# Altium schematic sheet hdmi.SchDoc
size 386 x 246 mm
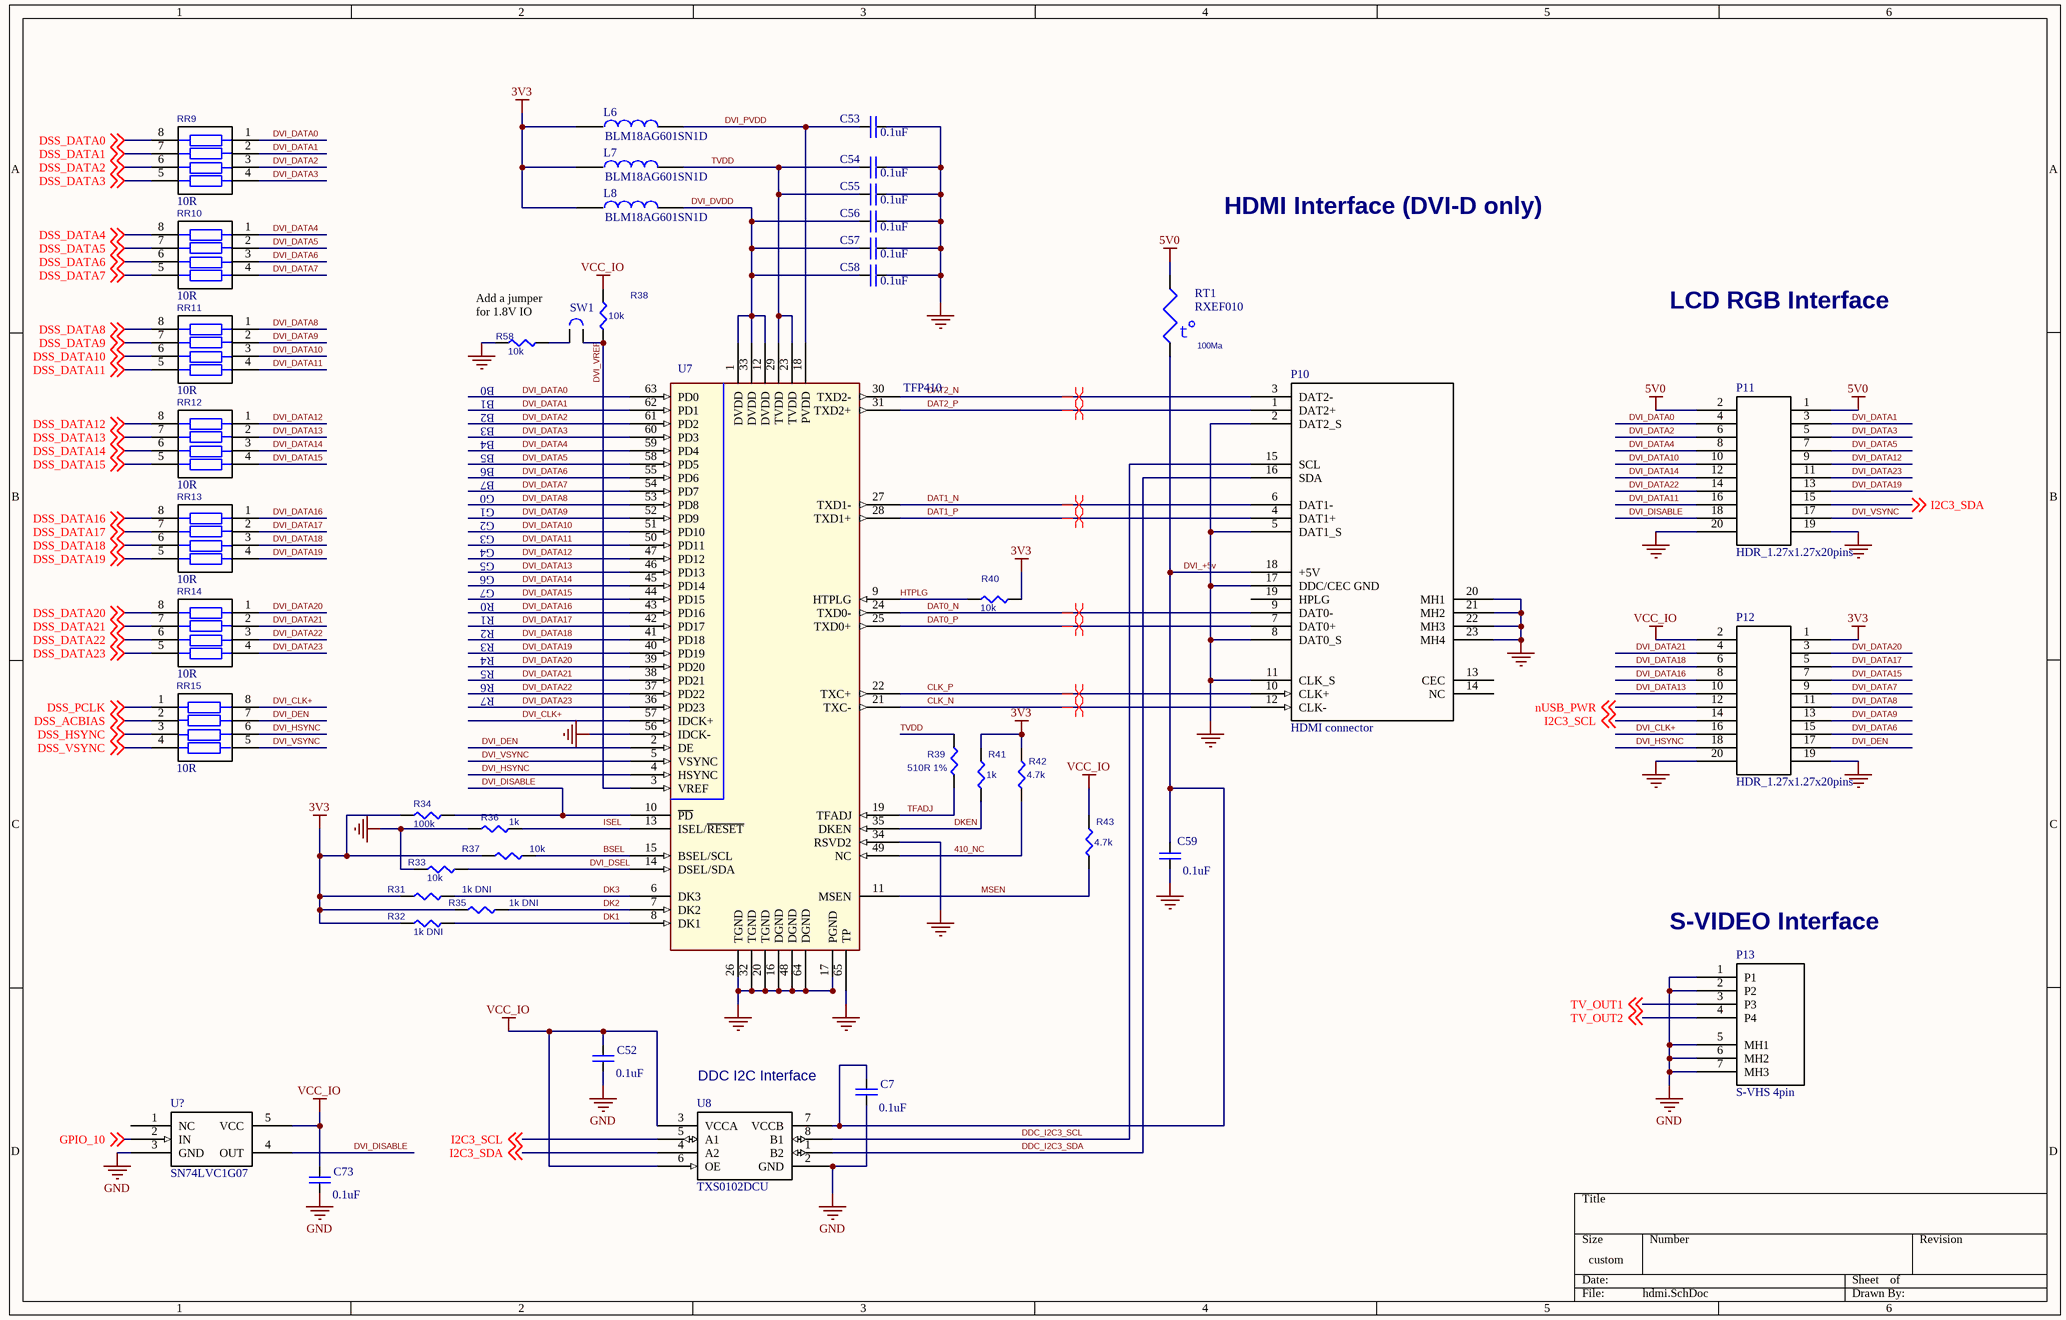
[diagram p0: hdmi.SchDoc]

## Parts
C7  value 0.1uF  [CHIP0603]  (hidden comment: C0603)
C52  value 0.1uF  [CHIP0603]  (hidden comment: C0603)
C53  value 0.1uF  [CHIP0603]  (hidden comment: C0603)
C54  value 0.1uF  [CHIP0603]  (hidden comment: C0603)
C55  value 0.1uF  [CHIP0603]  (hidden comment: C0603)
C56  value 0.1uF  [CHIP0603]  (hidden comment: C0603)
C57  value 0.1uF  [CHIP0603]  (hidden comment: C0603)
C58  value 0.1uF  [CHIP0603]  (hidden comment: C0603)
C59  value 0.1uF  [CHIP0603]  (hidden comment: C0603)
C73  value 0.1uF  [CHIP0603]  (hidden comment: C0603)
L6  Man P/N: BLM18AG601SN1D  [CHIP0603]  (hidden comment: BLM18A-FB)
L7  Man P/N: BLM18AG601SN1D  [CHIP0603]  (hidden comment: BLM18A-FB)
L8  Man P/N: BLM18AG601SN1D  [CHIP0603]  (hidden comment: BLM18A-FB)
P10  HDMI connector  [HDMI connector]
P11  HDR_1.27x1.27x20pins  [MHDR2X10]
P12  HDR_1.27x1.27x20pins  [MHDR2X10]
P13  S-VHS 4pin  [MDN-4FR]
R31  value 1k DNI  [CHIP0603]  (hidden comment: R0603)
R32  value 1k DNI  [CHIP0603]  (hidden comment: R0603)
R33  value 10k  [CHIP0603]  (hidden comment: R0603)
R34  value 100k  [CHIP0603]  (hidden comment: R0603)
R35  value 1k DNI  [CHIP0603]  (hidden comment: R0603)
R36  value 1k  [CHIP0603]  (hidden comment: R0603)
R37  value 10k  [CHIP0603]  (hidden comment: R0603)
R38  value 10k  [CHIP0603]  (hidden comment: R0603)
R39  value 510R 1%  [CHIP0603]  (hidden comment: R0603)
R40  value 10k  [CHIP0603]  (hidden comment: R0603)
R41  value 1k  [CHIP0603]  (hidden comment: R0603)
R42  value 4.7k  [CHIP0603]  (hidden comment: R0603)
R43  value 4.7k  [CHIP0603]  (hidden comment: R0603)
R58  value 10k  [CHIP0603]  (hidden comment: R0603)
RR9  value 10R  [PACKAGE-J4]  (hidden comment: CAY-J4)
RR10  value 10R  [PACKAGE-J4]  (hidden comment: CAY-J4)
RR11  value 10R  [PACKAGE-J4]  (hidden comment: CAY-J4)
RR12  value 10R  [PACKAGE-J4]  (hidden comment: CAY-J4)
RR13  value 10R  [PACKAGE-J4]  (hidden comment: CAY-J4)
RR14  value 10R  [PACKAGE-J4]  (hidden comment: CAY-J4)
RR15  value 10R  [PACKAGE-J4]  (hidden comment: CAY-J4)
RT1  Man P/N: RXEF010  [PTC]  (hidden comment: PTC)
SW1  Jumper 2-pin  [JUMPER_2]  (value not drawn)
U7  TFP410  [PQFP64]
U8  TXS0102DCU  [PDSO8_DCU]
U?  SN74LVC1G07

## Nets
3V3: L6.1 L7.1 L8.1 P12.1 R31.1 R32.1 R34.1 R35.1 R37.1 R40.2 R41.1 R42.1
5V0: P11.1 P11.2 RT1.1
GND: C7.1 C52.1 C53.2 C54.2 C55.2 C56.2 C57.2 C58.2 C59.2 C73.1 P10.2(DAT2_S) P10.5(DAT1_S) P10.8(DAT0_S) P10.11(CLK_S) P10.17(DDC/CEC_GND) P10.20(MH1) P10.21(MH2) P10.22(MH3) P10.23(MH4) P11.19 P11.20 P12.19 P12.20 P13.1(P1) P13.2(P2) P13.5(MH1) P13.6(MH2) P13.7(MH3) R33.1 R36.1 R58.1 U7.16(DGND) U7.17(PGND) U7.20(TGND) U7.26(TGND) U7.32(TGND) U7.34(RSVD2) U7.48(DGND) U7.56(IDCK-) U7.64(DGND) U7.65(TP) U8.2(GND) U?.3(GND)
VCC_IO: C52.2 C73.2 P12.2 R38.1 R43.1 U8.3(VCCA) U8.6(OE) U?.5(VCC)
410_NC: R42.2 U7.49(NC)
BSEL: R37.2 U7.15(BSEL/SCL)
CLK_N: P10.12(CLK-) U7.21(TXC-)
CLK_P: P10.10(CLK+) U7.22(TXC+)
DAT0_N: P10.9(DAT0-) U7.24(TXD0-)
DAT0_P: P10.7(DAT0+) U7.25(TXD0+)
DAT1_N: P10.6(DAT1-) U7.27(TXD1-)
DAT1_P: P10.4(DAT1+) U7.28(TXD1+)
DAT2_N: P10.3(DAT2-) U7.30(TXD2-)
DAT2_P: P10.1(DAT2+) U7.31(TXD2+)
DDC_I2C3_SCL: P10.15(SCL) U8.8(B1)
DDC_I2C3_SDA: P10.16(SDA) U8.1(B2)
DK1: R32.2 U7.8(DK1)
DK2: R35.2 U7.7(DK2)
DK3: R31.2 U7.6(DK3)
DKEN: R41.2 U7.35(DKEN)
DSS_ACBIAS: RR15.2 ; off-sheet DSS_ACBIAS
DSS_DATA0: RR9.8 ; off-sheet DSS_DATA0
DSS_DATA1: RR9.7 ; off-sheet DSS_DATA1
DSS_DATA2: RR9.6 ; off-sheet DSS_DATA2
DSS_DATA3: RR9.5 ; off-sheet DSS_DATA3
DSS_DATA4: RR10.8 ; off-sheet DSS_DATA4
DSS_DATA5: RR10.7 ; off-sheet DSS_DATA5
DSS_DATA6: RR10.6 ; off-sheet DSS_DATA6
DSS_DATA7: RR10.5 ; off-sheet DSS_DATA7
DSS_DATA8: RR11.8 ; off-sheet DSS_DATA8
DSS_DATA9: RR11.7 ; off-sheet DSS_DATA9
DSS_DATA10: RR11.6 ; off-sheet DSS_DATA10
DSS_DATA11: RR11.5 ; off-sheet DSS_DATA11
DSS_DATA12: RR12.8 ; off-sheet DSS_DATA12
DSS_DATA13: RR12.7 ; off-sheet DSS_DATA13
DSS_DATA14: RR12.6 ; off-sheet DSS_DATA14
DSS_DATA15: RR12.5 ; off-sheet DSS_DATA15
DSS_DATA16: RR13.8 ; off-sheet DSS_DATA16
DSS_DATA17: RR13.7 ; off-sheet DSS_DATA17
DSS_DATA18: RR13.6 ; off-sheet DSS_DATA18
DSS_DATA19: RR13.5 ; off-sheet DSS_DATA19
DSS_DATA20: RR14.8 ; off-sheet DSS_DATA20
DSS_DATA21: RR14.7 ; off-sheet DSS_DATA21
DSS_DATA22: RR14.6 ; off-sheet DSS_DATA22
DSS_DATA23: RR14.5 ; off-sheet DSS_DATA23
DSS_HSYNC: RR15.3 ; off-sheet DSS_HSYNC
DSS_PCLK: RR15.1 ; off-sheet DSS_PCLK
DSS_VSYNC: RR15.4 ; off-sheet DSS_VSYNC
DVI_+5v: C7.2 C59.1 P10.18(+5V) RT1.2 U8.7(VCCB)
DVI_CLK+: P12.16 RR15.8 U7.57(IDCK+)
DVI_DATA0: P11.4 RR9.1 U7.63(PD0)
DVI_DATA1: P11.3 RR9.2 U7.62(PD1)
DVI_DATA2: P11.6 RR9.3 U7.61(PD2)
DVI_DATA3: P11.5 RR9.4 U7.60(PD3)
DVI_DATA4: P11.8 RR10.1 U7.59(PD4)
DVI_DATA5: P11.7 RR10.2 U7.58(PD5)
DVI_DATA6: P12.15 RR10.3 U7.55(PD6)
DVI_DATA7: P12.9 RR10.4 U7.54(PD7)
DVI_DATA8: P12.11 RR11.1 U7.53(PD8)
DVI_DATA9: P12.13 RR11.2 U7.52(PD9)
DVI_DATA10: P11.10 RR11.3 U7.51(PD10)
DVI_DATA11: P11.16 RR11.4 U7.50(PD11)
DVI_DATA12: P11.9 RR12.1 U7.47(PD12)
DVI_DATA13: P12.10 RR12.2 U7.46(PD13)
DVI_DATA14: P11.12 RR12.3 U7.45(PD14)
DVI_DATA15: P12.7 RR12.4 U7.44(PD15)
DVI_DATA16: P12.8 RR13.1 U7.43(PD16)
DVI_DATA17: P12.5 RR13.2 U7.42(PD17)
DVI_DATA18: P12.6 RR13.3 U7.41(PD18)
DVI_DATA19: P11.13 RR13.4 U7.40(PD19)
DVI_DATA20: P12.3 RR14.1 U7.39(PD20)
DVI_DATA21: P12.4 RR14.2 U7.38(PD21)
DVI_DATA22: P11.14 RR14.3 U7.37(PD22)
DVI_DATA23: P11.11 RR14.4 U7.36(PD23)
DVI_DEN: P12.17 RR15.7 U7.2(DE)
DVI_DISABLE: P11.18 R34.2 U7.10(~{PD}) U?.4(OUT)
DVI_DSEL: R33.2 U7.14(DSEL/SDA)
DVI_DVDD: C56.1 C57.1 C58.1 L8.2 U7.1(DVDD) U7.12(DVDD) U7.33(DVDD)
DVI_HSYNC: P12.18 RR15.6 U7.4(HSYNC)
DVI_PVDD: C53.1 L6.2 U7.18(PVDD)
DVI_VREF: R38.2 SW1.2 U7.3(VREF)
DVI_VSYNC: P11.17 RR15.5 U7.5(VSYNC)
GPIO_10: U?.2(IN) ; off-sheet GPIO_10
HTPLG: R40.1 U7.9(HTPLG)
I2C3_SCL: P12.14 U8.5(A1) ; off-sheet I2C3_SCL
I2C3_SDA: P11.15 U8.4(A2) ; off-sheet I2C3_SDA
ISEL: R36.2 U7.13(ISEL/~{RESET})
MSEN: R43.2 U7.11(MSEN)
nUSB_PWR: P12.12 ; off-sheet nUSB_PWR
TFADJ: R39.2 U7.19(TFADJ)
TV_OUT1: P13.3(P3) ; off-sheet TV_OUT1
TV_OUT2: P13.4(P4) ; off-sheet TV_OUT2
TVDD: C54.1 C55.1 L7.2 R39.1 U7.23(TVDD) U7.29(TVDD)
NetR58_2: R58.2 SW1.1

Not connected (* = marked no-connect by the designer): P10 13(CEC) 14(NC) 19(HPLG); U? 1(NC)

## Layout directives
differential pair: CLK_N, CLK_P, DAT0_N, DAT0_P, DAT1_N, DAT1_P, DAT2_N, DAT2_P

## Notes on the sheet
- HDMI Interface (DVI-D only)
- (near SW1) Add a jumper
  for 1.8V IO
- LCD RGB Interface
- B1
- (near R58) B0
- (near RT1) 100Ma
- B5
- B4
- B3
- B2
- B6
- B7
- G0
- G1
- G2
- G3
- G5
- G4
- G6
- G7
- R0
- R1
- R2
- R3
- R4
- R5
- R6
- R7
- (near P13) S-VIDEO Interface
- DDC I2C Interface
- (in symbol PTC) t

## Library data of the parts
C7 C52-C59 C73 = C0603: Ceramic capacitor C0603
L6-L8 = BLM18A-FB: Chip EMIFILr Inductor Type; Manufacturer: Murata
P10 = HDMI connector: 1.0 HDMI RIGHT ANGLE 19-pin; Man P/N A: Molex 47151-0001; Man P/N: PulseEng E810K-SB0G1X-L
P11 P12 = HDR_1.27x1.27x20pins: Dual Raw Socket Strip; Manufacturer: Major League; Man P/N: TSHC-510-D-06-340-G-LF
P13 = S-VHS 4pin: S-Video PCB-Connector 4 pin; URL: http://www.brownbear.ru/goods/2398.html; Man P/N: MDN-4FR
R31-R43 R58 = R0603: Resistor 0603
RR9-RR15 = CAY-J4: Resistor network 4x
RT1 = PTC: POLYSWITCH PTC RESET 0.1A; Manufacturer: TE Connectivity
SW1 = Jumper 2-pin: Jumper 2-pin 2.54mm
U7 = tfp513_1: TI PanelBus digital transmitter; Man P/N: TFP410PAP; Manufacturer: TI
U8 = TXS0102DCU: 2bit Bidirectional voltage translator; Manufacturer: TI; Package: DCU; Man P/N: TXS0102DCU
U? = SN74LVC1G07: SINGLE BUFFER/DRIVER WITH OPEN-DRAIN OUTPUT; Man P/N: SN74LVC1G07DCKT; Package: DCK